# Altium project WIFI.PrjPcb
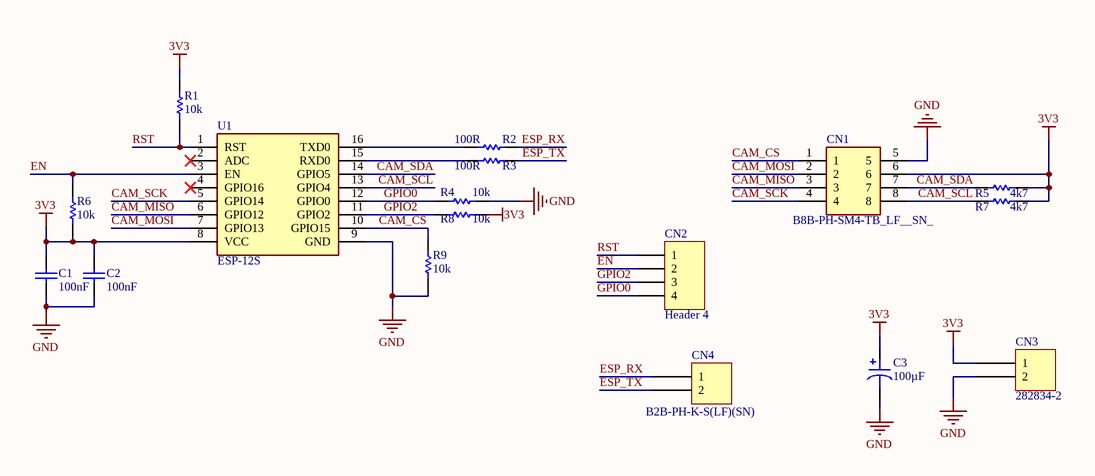
[diagram p0: WIFI.SchDoc]
1 sheet, 17 parts. Net scope: global (net labels, ports and power ports of the same name join across sheets).
Board file: PCB2.PcbDoc

## Sheet WIFI.SchDoc
size A4; SheetNumber: 1; SheetTotal: 1

### Parts
C1  value 100nF  [1608[0603]]  (hidden comment: Cap)
C2  value 100nF  [1608[0603]]  (hidden comment: Cap)
C3  100µF  [CAP ALSMD POLY 5.3MM H6.0MM]
CN1  B8B-PH-SM4-TB_LF__SN_  [B8B-PH-SM4-TB]
CN2  Header 4  [HDR1X4]
CN3  282834-2  [TE 282834-2]
CN4  B2B-PH-K-S(LF)(SN)  [JST B2B-PH-K]
R1  value 10k  [1608[0603]]  (hidden comment: Res1)
R2  value 100R  [1608[0603]]  (hidden comment: Res1)
R3  value 100R  [1608[0603]]  (hidden comment: Res1)
R4  value 10k  [1608[0603]]  (hidden comment: Res1)
R5  value 4k7  [1608[0603]]  (hidden comment: Res1)
R6  value 10k  [1608[0603]]  (hidden comment: Res1)
R7  value 4k7  [1608[0603]]  (hidden comment: Res1)
R8  value 10k  [1608[0603]]  (hidden comment: Res1)
R9  value 10k  [1608[0603]]  (hidden comment: Res1)
U1  ESP-12S  [ESP12S]

### Nets
3V3: C1.1 C2.1 C3.1 CN1.6 CN3.1 R1.2 R5.2 R6.2 R7.2 R8.2 U1.8(VCC)
GND: C1.2 C2.2 C3.2 CN1.5 CN3.2 R4.2 R9.2 U1.9(GND)
CAM_CS: CN1.1 R9.1 U1.10(GPIO15)
CAM_MISO: CN1.3 U1.6(GPIO12)
CAM_MOSI: CN1.2 U1.7(GPIO13)
CAM_SCK: CN1.4 U1.5(GPIO14)
CAM_SCL: CN1.8 R7.1 U1.13(GPIO4)
CAM_SDA: CN1.7 R5.1 U1.14(GPIO5)
EN: CN2.2 R6.1 U1.3(EN)
ESP_RX: CN4.1 R2.1
ESP_TX: CN4.2 R3.1
GPIO0: CN2.4 R4.1 U1.12(GPIO0)
GPIO2: CN2.3 R8.1 U1.11(GPIO2)
RST: CN2.1 R1.1 U1.1(RST)
NetR2_2: R2.2 U1.16(TXD0)
NetR3_2: R3.2 U1.15(RXD0)

Not connected (* = marked no-connect by the designer): U1 2(ADC)* 4(GPIO16)*

### Library data of the parts
C1 C2 = Cap: Capacitor; Published: 8-Jun-2000; LatestRevisionDate: 17-Jul-2002; LatestRevisionNote: Re-released for DXP Platform.; PackageReference: RAD-0.3; Publisher: Altium Limited; PackageDescription: Radial Cap, Thru-Hole; 2 Leads; 0.3 in Pin Spacing
C3 = 6SVPC100M: CAP ALUM POLY 100UF 20% 6.3V SMD; manufacturer: Panasonic Electronic Components; ESR (Equivalent Series Resistance): 30mOhm; Lifetime @ Temp.: 2000 Hrs @ 105°C; Ripple Current @ High Frequency: 2.15A @ 100kHz; Ripple Current @ Low Frequency: 107.5mA @ 120Hz; Surface Mount Land Size: 0.209" L x 0.209" W (5.30mm x 5.30mm); Type: Polymer; Part Number: 6SVPC100M; Applications: General Purpose; Capacitance: 100µF; componentlink1description: Datasheet; componentlink1url: https://industrial.panasonic.com/cdbs/www-data/pdf/AAB8000/AAB8000C256.pdf; componentlink2description: DigiKey Link; componentlink2url: http://digikey.com/product-detail/en/panasonic-electronic-components/6SVPC100M/P16606CT-ND/4204442; Device Package: Radial, Can - SMD; Height - Seated (Max): 0.236" (6.00mm); lastupdated: 9/2/2020 1:22:07 AM; Lifecycle Status: Active; Minimum Order: 1; Mounting Type: Surface Mount; Operating Temperature: -55°C ~ 105°C; Package / Case: Radial, Can - SMD; packaging: TapeAndReel; partid: 1943; Part Status: Active; price: 0.51; series: OS-CON™, SVPC; Size / Dimension: 0.197" Dia (5.00mm); Supplier 1: DigiKey; Supplier Part Number 1: P16606CT-ND; Tolerance: ±20%; value: 100µF; Voltage - Rated: 6.3V
CN1 = B8B-PH-SM4-TB_LF__SN_: Connector; Manufacturer_Name: JST (JAPAN SOLDERLESS TERMINALS); Manufacturer_Part_Number: B8B-PH-SM4-TB(LF)(SN); Datasheet Link: http://uk.rs-online.com/web/p/products/6881347; Arrow Part Number: B8B-PH-SM4-TB(LF)(SN); Arrow Price/Stock: https://www.arrow.com/en/products/b8b-ph-sm4-tb-lf-sn/jst-manufacturing?region=europe
CN2 = Header 4: Header, 4-Pin; LatestRevisionDate: 17-Jul-2002; LatestRevisionNote: Re-released for DXP Platform.; Publisher: Altium Limited
CN3 = 282834-2: TERM BLK 2P SIDE ENT 2.54MM PCB; Manufacturer: TE Connectivity AMP Connectors; Current: 10A; Mating Orientation: Horizontal with Board; Number of Levels: 1; Pitch: 0.100" (2.54mm); Positions Per Level: 2; Voltage: 150V; Wire Gauge: 16-30 AWG; Wire Termination: Screw - Rising Cage Clamp; Part Number: 282834-2; Color: Green; ComponentLink1Description: Datasheet; ComponentLink1URL: https://www.te.com/commerce/DocumentDelivery/DDEController?Action=srchrtrv&DocNm=282834&DocType=Customer+Drawing&DocLang=English; ComponentLink2Description: DigiKey Link; ComponentLink2URL: http://digikey.com/product-detail/en/te-connectivity-amp-connectors/282834-2/A98333-ND/1150135; LastUpdated: 1/15/2020 4:15:38 AM; Lifecycle Status: Active; Minimum Order: 1; Mounting Type: Through Hole; Packaging: Bulk; Part Status: Active; Price: 0.88; Series: Buchanan; Supplier 1: DigiKey; Supplier Part Number 1: A98333-ND
CN4 = B2B-PH-K-S(LF)(SN): CONN HEADER VERT 2POS 2MM; Manufacturer: JST Sales America Inc.; Contact Length - Mating: 0.130" (3.30mm); Contact Length - Post: 0.134" (3.40mm); Current Rating (Amps): 2A; Material Flammability Rating: UL94 V-0; Number of Positions: 2; Number of Positions Loaded: All; Overall Contact Length: 0.333" (8.45mm); Pitch - Mating: 0.079" (2.00mm); Shrouding: Shrouded - 4 Wall; Style: Board to Cable/Wire; Voltage Rating: 100V; Part Number: B2B-PH-K-S(LF)(SN); ComponentLink1Description: Datasheet; ComponentLink1URL: http://www.jst-mfg.com/product/pdf/eng/ePH.pdf; ComponentLink2Description: DigiKey Link; ComponentLink2URL: http://digikey.com/product-detail/en/jst-sales-america-inc/B2B-PH-K-S-LF-SN/455-1704-ND/926611; Connector Type: Header; Contact Finish - Mating: Tin; Contact Finish - Post: Tin; Contact Material: Brass; Contact Shape: Square; Contact Type: Male Pin; Fastening Type: Detent Lock; Insulation Color: Natural; Insulation Height: 0.236" (6.00mm); Insulation Material: Polyamide (PA66), Nylon 6/6; LastUpdated: 1/3/2020 11:40:58 PM; Lifecycle Status: Active; Minimum Order: 1; Mounting Type: Through Hole; Number of Rows: 1; Operating Temperature: -25°C ~ 85°C; Packaging: Bulk; PartId: 11; Part Status: Active; Price: 0.17; Series: PH; Supplier 1: DigiKey; Supplier Part Number 1: 455-1704-ND; Termination: Press-Fit, Solder
R1-R9 = Res1: Resistor; Published: 8-Jun-2000; LatestRevisionDate: 17-Jul-2002; LatestRevisionNote: Re-released for DXP Platform.; PackageReference: AXIAL-0.3; Publisher: Altium Limited; PackageDescription: Axial Device, Thru-Hole; 2 Leads; 0.3 in Pin Spacing
U1 = ESP-12S: Integrated Circuit; Manufacturer_Name: RF SOLUTIONS; Datasheet Link: https://datasheet.datasheetarchive.com/originals/distributors/DKDS42/DSANUWW0049619.pdf; Height: 3mm; Manufacturer_Part_Number: ESP-12S; Mouser Part Number: 223-ESP-12S; Mouser Price/Stock: https://www.mouser.co.uk/ProductDetail/RF-Solutions/ESP-12S?qs=UkDUCjYnTB27YArJ5wHUxg%3D%3D